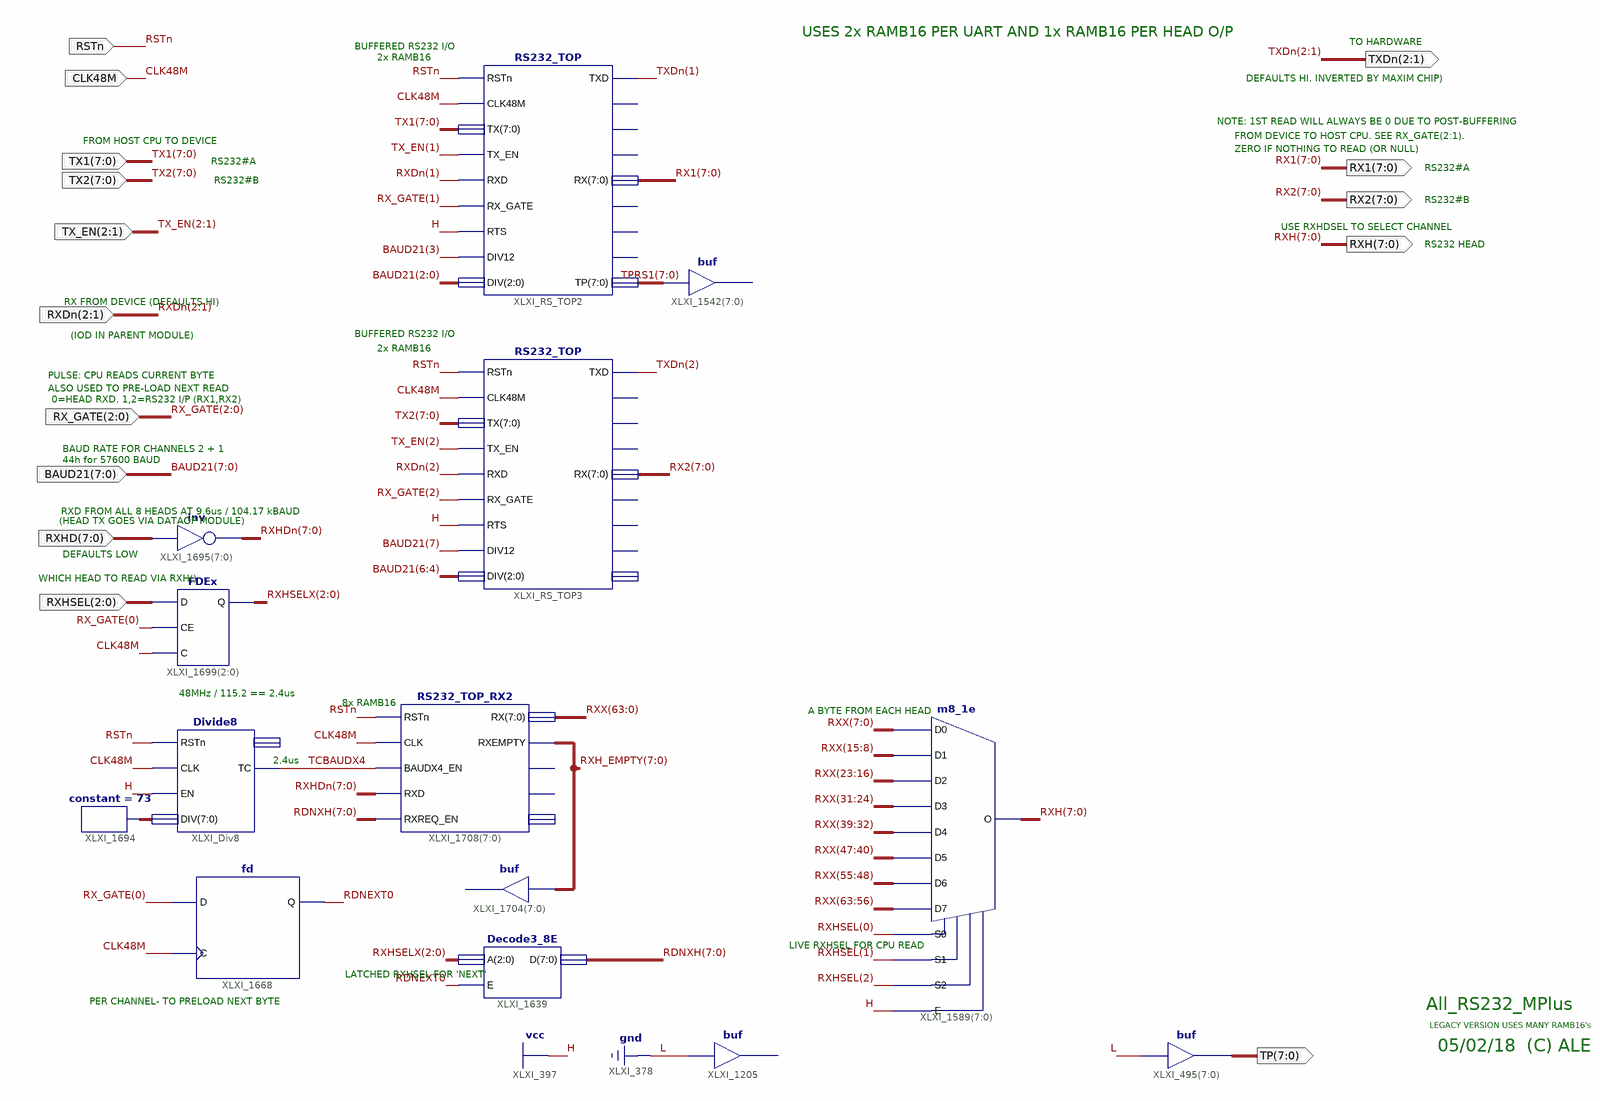
[diagram p0: schematic sheet 1]
// Xilinx ISE schematic All_RS232_MPlus.sch (spartan3e) as structural Verilog: 14 symbols, 15 ports
module All_RS232_MPlus (
  input  CLK48M,
  input  RSTn,
  input  [7:0] TX1,
  input  [7:0] TX2,
  input  [2:1] TX_EN,
  input  [2:1] RXDn,
  input  [2:0] RX_GATE,
  input  [7:0] BAUD21,
  input  [2:0] RXHSEL,
  input  [7:0] RXHD,
  output [2:1] TXDn,
  output [7:0] RX1,
  output [7:0] RX2,
  output [7:0] RXH,
  output [7:0] TP
);

  wire RDNEXT0, TCBAUDX4;
  wire [2:0] RXHSELX;
  wire [7:0] RDNXH, RXH_EMPTY, RXHDn, TPRS1, XLXN_2253;
  wire [63:0] RXX;

  assign TP = {8{1'b0}};  // buf XLXI_495[7..0], 8 bits wide
  Divide8 XLXI_Div8 (.CLK(CLK48M), .DIV(XLXN_2253), .EN(1'b1), .RSTn(RSTn), .TC(TCBAUDX4));  // open: CUP
  constant #(.CValue("73")) XLXI_1694 (.O(XLXN_2253));
  Decode3_8E XLXI_1639 (.A(RXHSELX), .D(RDNXH), .E(RDNEXT0));
  FDEx XLXI_1699[2:0] (.C(CLK48M), .CE(RX_GATE[0]), .D(RXHSEL), .Q(RXHSELX));
  assign RXHDn = ~RXHD;  // inv XLXI_1695[7..0], 8 bits wide
  // buf XLXI_1205 has open pins: I=1'b0, O=open
  // buf XLXI_1704[7..0] has open pins: I=RXH_EMPTY, O=open
  RS232_TOP XLXI_RS_TOP2 (
    .CLK48M(CLK48M), .DIV(BAUD21[2:0]), .DIV12(BAUD21[3]), .RSTn(RSTn), .RTS(1'b1), .RX(RX1), .RXD(RXDn[1]),
    .RX_GATE(RX_GATE[1]), .TP(TPRS1), .TX(TX1), .TXD(TXDn[1]), .TX_EN(TX_EN[1]));  // open: RXEMPTY, RXERR, RXFULL, TXEMPTY, TXERR, TXFULL
  RS232_TOP XLXI_RS_TOP3 (
    .CLK48M(CLK48M), .DIV(BAUD21[6:4]), .DIV12(BAUD21[7]), .RSTn(RSTn), .RTS(1'b1), .RX(RX2), .RXD(RXDn[2]),
    .RX_GATE(RX_GATE[2]), .TX(TX2), .TXD(TXDn[2]), .TX_EN(TX_EN[2]));  // open: RXEMPTY, RXERR, RXFULL, TP, TXEMPTY, TXERR, TXFULL
  RS232_TOP_RX2 XLXI_1708[7:0] (
    .BAUDX4_EN(TCBAUDX4), .CLK(CLK48M), .RSTn(RSTn), .RX(RXX), .RXD(RXHDn), .RXEMPTY(RXH_EMPTY),
    .RXREQ_EN(RDNXH));  // open: RXERR, RXFULL, TP
  // buf XLXI_1542[7..0] has open pins: I=TPRS1, O=open
  fd XLXI_1668 (.C(CLK48M), .D(RX_GATE[0]), .Q(RDNEXT0));
  m8_1e XLXI_1589[7:0] (
    .D0(RXX[7:0]), .D1(RXX[15:8]), .D2(RXX[23:16]), .D3(RXX[31:24]), .D4(RXX[39:32]), .D5(RXX[47:40]),
    .D6(RXX[55:48]), .D7(RXX[63:56]), .E(1'b1), .S0(RXHSEL[0]), .S1(RXHSEL[1]), .S2(RXHSEL[2]), .O(RXH));

  // Notes on the sheet:
  //   USES 2x RAMB16 PER UART AND 1x RAMB16 PER HEAD O/P
  //   TO HARDWARE
  //   BUFFERED RS232 I/O
  //   2x RAMB16
  //   DEFAULTS HI. INVERTED BY MAXIM CHIP)
  //   NOTE: 1ST READ WILL ALWAYS BE 0 DUE TO POST-BUFFERING
  //   FROM DEVICE TO HOST CPU. SEE RX_GATE(2:1).
  //   FROM HOST CPU TO DEVICE
  //   ZERO IF NOTHING TO READ (OR NULL)
  //   RS232#A
  //   RS232#A
  //   RS232#B
  //   RS232#B
  //   USE RXHDSEL TO SELECT CHANNEL
  //   RS232 HEAD
  //   RX FROM DEVICE (DEFAULTS HI)
  //   BUFFERED RS232 I/O
  //   (IOD IN PARENT MODULE)
  //   2x RAMB16
  //   PULSE: CPU READS CURRENT BYTE
  //   ALSO USED TO PRE-LOAD NEXT READ
  //   0=HEAD RXD. 1,2=RS232 I/P (RX1,RX2)
  //   BAUD RATE FOR CHANNELS 2 + 1
  //   44h for 57600 BAUD
  //   RXD FROM ALL 8 HEADS AT 9.6us / 104.17 kBAUD
  //   (HEAD TX GOES VIA DATAOP MODULE)
  //   DEFAULTS LOW
  //   WHICH HEAD TO READ VIA RXH()
  //   48MHz / 115.2 == 2.4us
  //   8x RAMB16
  //   A BYTE FROM EACH HEAD
  //   2.4us
  //   LIVE RXHSEL FOR CPU READ
  //   LATCHED RXHSEL FOR 'NEXT'
  //   PER CHANNEL- TO PRELOAD NEXT BYTE
  //   All_RS232_MPlus
  //   LEGACY VERSION USES MANY RAMB16's
  //   05/02/18  (C) ALE
endmodule
